# Altium schematic sheet MCU.SchDoc
size A3; SheetNumber: 2; SheetTotal: 5
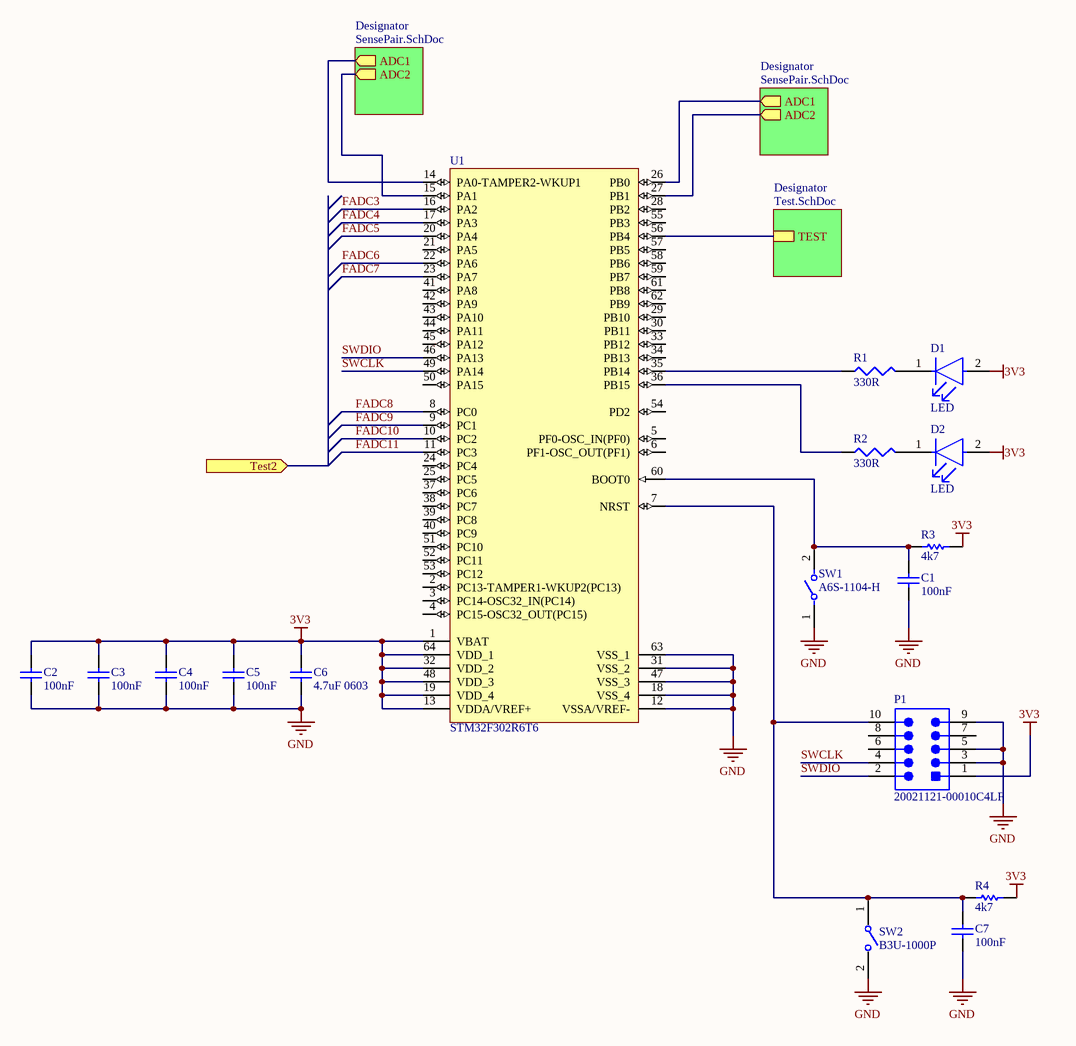
[diagram p0: MCU.SchDoc]

## Parts
C1  100nF  [CAPC1608X90X35LL15T15]
C2  100nF  [CAPC1608X90X35LL15T15]
C3  100nF  [CAPC1608X90X35LL15T15]
C4  100nF  [CAPC1608X90X35LL15T15]
C5  100nF  [CAPC1608X90X35LL15T15]
C6  4.7uF 0603  [CAPC1608X90X30LL10T20]
C7  100nF  [CAPC1608X90X35LL15T15]
D1  LED  [FP-LTST-C191TBKT-MFG]
D2  LED  [FP-LTST-C191TBKT-MFG]
P1  20021121-00010C4LF  [HDR2X5_SMT]
R1  330R  [J1-0603]
R2  330R  [J1-0603]
R3  4k7  [RESC1608X55X25LL10T15]
R4  4k7  [RESC1608X55X25LL10T15]
SW1  A6S-1104-H  [FP-A6S-1104-H-MFG]
SW2  B3U-1000P  [FP-B3U-1000P-MFG]
U1  STM32F302R6T6  [STM-LQFP64_L]

## Sub-sheets
Designator = Test.SchDoc: TEST
Designator = SensePair.SchDoc: ADC1 (out), ADC2 (out)
Designator = SensePair.SchDoc: ADC1 (out), ADC2 (out)

## Ports
Test2 (in)

## Nets
3V3: C2.2 C3.2 C4.2 C5.2 C6.2 D1.2(A) D2.2(A) P1.1 R3.1 R4.1 U1.1(VBAT) U1.13(VDDA/VREF+) U1.19(VDD_4) U1.32(VDD_2) U1.48(VDD_3) U1.64(VDD_1)
GND: C1.1 C2.1 C3.1 C4.1 C5.1 C6.1 C7.1 P1.3 P1.5 P1.9 SW1.1 SW2.2 U1.12(VSSA/VREF-) U1.18(VSS_4) U1.31(VSS_2) U1.47(VSS_3) U1.63(VSS_1)
FADC3: U1.16(PA2)
FADC4: U1.17(PA3)
FADC5: U1.20(PA4)
FADC6: U1.22(PA6)
FADC7: U1.23(PA7)
FADC8: U1.8(PC0)
FADC9: U1.9(PC1)
FADC10: U1.10(PC2)
FADC11: U1.11(PC3)
SWCLK: P1.4 U1.49(PA14)
SWDIO: P1.2 U1.46(PA13)
NetC1_2: C1.2 R3.2 SW1.2 U1.60(BOOT0)
NetC7_2: C7.2 P1.10 R4.2 SW2.1 U1.7(NRST)
NetD1_1: D1.1(C) R1.2
NetD2_1: D2.1(C) R2.2
NetR1_1: R1.1 U1.35(PB14)
NetR2_1: R2.1 U1.36(PB15)
NetU1_14: U1.14(PA0-TAMPER2-WKUP1) ; sheet Designator/ADC1
NetU1_15: U1.15(PA1) ; sheet Designator/ADC2
NetU1_26: U1.26(PB0) ; sheet Designator/ADC1
NetU1_27: U1.27(PB1) ; sheet Designator/ADC2
NetU1_56: U1.56(PB4) ; sheet Designator/TEST

Not connected (* = marked no-connect by the designer): P1 6 7 8; U1 2(PC13-TAMPER1-WKUP2(PC13)) 3(PC14-OSC32_IN(PC14)) 4(PC15-OSC32_OUT(PC15)) 5(PF0-OSC_IN(PF0)) 6(PF1-OSC_OUT(PF1)) 21(PA5) 24(PC4) 25(PC5) 28(PB2) 29(PB10) 30(PB11) 33(PB12) 34(PB13) 37(PC6) 38(PC7) 39(PC8) 40(PC9) 41(PA8) 42(PA9) 43(PA10) 44(PA11) 45(PA12) 50(PA15) 51(PC10) 52(PC11) 53(PC12) 54(PD2) 55(PB3) 57(PB5) 58(PB6) 59(PB7) 61(PB8) 62(PB9)

## Library data of the parts
C1-C5 C7 = CMP-2006-04199-2: Chip Capacitor, 100 nF, 25 V, -30 to 85 degC, 0603 (1608 Metric), RoHS, Tape and Reel; Manufacturer: AVX; Dielectric: Y5V; Rated Voltage: 25V; Tolerance (%): -20to+80%; Datasheet Version: 01/2010; Package Description: 2-Pin Surface Mount Device, Body 1.6 x 0.8 mm; Manufacturer URL: http://www.avx.com/; Datasheet URL: http://datasheet.octopart.com/06033G104ZAT2A-AVX-datasheet-8445862.pdf; Package Reference: 0603; Case Size/Dimension: 0603; Mounting Technology: SurfaceMount; Capacitance: 100nF
C6 = CMP-2000-06090-1: Chip Capacitor, 4.7 uF, +/- 10%, 6.3 V, -55 to 85 degC, 0603 (1608 Metric), RoHS, Tape and Reel; Manufacturer: Samsung Electro-Mechanics; Dielectric: X5R; Capacitance: 4700000pF; Rated Voltage: 6.3V; Manufacturer URL: http://www.samsungsem.com/global/index.jsp; Case Size/Dimension: 0603; Package Description: 2-Pin Surface Mount Device, Body 1.60 x 0.80 mm; Datasheet Version: 07/2016; Datasheet URL: http://www.samsungsem.com/kr/support/product-search/mlcc/__icsFiles/afieldfile/2016/08/18/S_CL10A475KQ8NNNC.pdf; Tolerance (%): ±10%; Mounting Technology: SurfaceMount; Package Reference: 0603
D1 D2 = CMP-22017-000008-1: LED BLUE CLEAR CHIP SMD; Lens Color: Colorless; Dominant Wavelength: 475nm; Forward Current: 20mA; Wavelength: 468nm; Viewing Angle: 130°; Power Dissipation: 76mW; Luminous Intensity: 180mcd; Reverse Voltage: 5V; Number of Elements: 1; Lens Style: Diffused; Forward Voltage: 3.8V; Max Power Dissipation: 75mW; Case Code (Metric): 1608; Packaging: Tape and Reel; Case/Package: 0603; Depth: 1.6mm; Mount: Surface Mount; Lead Free: Lead Free; Min Operating Temperature: -20°C; Lens Transparency: Clear; Illumination Color: Blue; Height: 0.55mm; Test Current: 20mA; Case Code (Imperial): 0603; Max Operating Temperature: 80°C; Number of Pins: 2; Length: 0.8mm; Radiation Hardening: No; Package Quantity: 1; Number of LEDs: 1; Width: 0.8mm; Color: Blue
P1 = CMP-2000-05523-1: Male Header, Pitch 1.27 mm, 2 x 5 Position, Height 4.55 mm, -40 to 85 degC, RoHS, Tape and Reel; Brand: FCI; Mating Post Length: 3.05mm; Voltage Rating: 125V; Contact resistance Max: 30MOhm; Number of Positions: 10; Pitch: 1.27mm; Current Rating: 1A; Stack Height: 3mm; Mounting Angle: Vertical; Package Version: Rev. J, 03/2013; Contact Plating: Gold; Packaging: Reel; Package Reference: 20021121; Termination Style: SMD; Series: Minitek; Mounting Technology: SurfaceMount; RoHS: Details; Manufacturer: FCI; Number of Rows: 2; Package Description: 10-Leads Header, Body 3.43 x 6.35, Pitch 1.27 mm; Datasheet URL: https://datasheet.ciiva.com/11749/0900766b8118d62a-11749057.pdf; Gender: Male; Mounting Style: SMD/SMT; Manufacturer URL: http://portal.fciconnect.com/; Factory Pack Quantity: 600; Type: Unshrouded; Number of Positions / Contacts: 10; Datasheet Version: 06/2011; Package URL: https://datasheet.ciiva.com/26853/getdatasheetpartid-177140-26853984.pdf; Product Type: Headers; Contact Material: CopperAlloy; Product Category: Headers&WireHousings
R1 = Res3: Resistor; Published: 8-Jun-2000; LatestRevisionDate: 29-May-2009; LatestRevisionNote: IPC-7351 Footprint Added.; PackageReference: J1-0603; Publisher: Altium Limited; PackageDescription: Chip Resistor
R2 = Res3: Resistor; Value: 1K; Published: 8-Jun-2000; LatestRevisionDate: 29-May-2009; LatestRevisionNote: IPC-7351 Footprint Added.; PackageReference: J1-0603; Publisher: Altium Limited; PackageDescription: Chip Resistor
R3 R4 = CMP-2000-06942-1: Chip Resistor, 4.7 KOhm, +/- 1%, 0.1 W, -55 to 155 degC, 0603 (1608 Metric), RoHS, Tape and Reel; Manufacturer: Yageo; Power Rating: 100mW; Temperature Coefficient: 100PPM/C; Resistance: 4.7kOhms; Voltage Rating: 50V; Package Reference: 0603; Series: RC; Datasheet Version: Rev. 7, 05/2017; Packaging: Reel; Termination Style: SMD/SMT; Datasheet URL: http://www.yageo.com/documents/recent/PYu-RC_Group_51_RoHS_L_7.pdf; Manufacturer URL: http://www.yageo.com/; Package Description: 2-Pin Surface Mount Device, Body 1.6 x 0.8 mm; Case Code - mm: 1608; Case Code - in: 0603; Mounting Technology: SurfaceMount; Operating Temperature Range: -55Cto+155C; Tolerance: 1%; Product: ThickFilmResistorsGeneralPurpose
SW1 = CMP-08827-000005-1: SWITCH SLIDE DIP SPST 25MA 24V; Manufacturer: Omron Electronics Inc-EMC Div; Throw Configuration: SPST-NO; Standoff Height: 0mm; Number Of Circuits: 1; Electromechanical Life: 1000Cycles; Contact Resistance: 200mΩ; Digikey Description: SWITCH SLIDE DIP SPST 25MA 24V; ComponentLink2Description: Datasheet; Mount: Surface Mount; Manufacturer Part Number: A6S-1104-H; ComponentLink2URL: https://omronfs.omron.com/en_US/ecb/products/pdf/en-a6s.pdf; Category: Switch; Height: 3.95mm; Device Class L3: DIP Switches; Octopart: https://octopart.com/a6s-1104-h-omron-55410938; Mouser Description: DIP Switches / SIP Switches Dip Switch; Lead Free: Yes; Temperature Range Low: -20°C; Temperature Range High: +70°C; Automotive: No; Ambient Temperature Range Low: -20°C; Ambient Temperature Range High: +70°C; Voltage Rating Dc: 24V; Device Class L2: Switches; RoHS: TRUE; Package: 0; Contact Current Rating: 25mA; Device Class L1: Electromechanical; Temperature: -20°C to +70°C
SW2 = CMP-2100-03586-2: SWITCH TACTILE SPST-NO 0.05A 12V; Contact Resistance: 100mR; Operating Force: 1.5N; Max Current Rating: 50mA; Switch Travel: 0.15mm; Actuator Type: Standard; Mechanical Life: 200000Cycles; Ratings: Dust Proof; Illumination Type: Non-Illuminated; Throw Configuration: SPST; Actuator Length: 0.4mm; Switch Function: Off-Mom; Height: 1.2mm; Width: 3mm; Weight: 0.000776oz; Contact Material: Silver; Max Voltage Rating (DC): 12V; Insulation Resistance: 100MR; Lead Free: Lead Free; Current Rating: 50mA; Termination: SMD/SMT; Length: 4mm; Voltage Rating (DC): 12V; Contact Current Rating: 50mA; Orientation: Straight; Depth: 2.5mm; Max Operating Temperature: 70°C; Packaging: Tape and Reel; Min Operating Temperature: -25°C; Package Quantity: 1; Mount: Surface Mount; Electrical Life: 200000Cycles
U1 = CMP-0537-00017-1: ARM Cortex-M4 32-bit MCU, 32 KB Flash, 16 KB Internal RAM, 51 I/Os, 64-Pin LQFP, -40 to 85 degC, Tray; Operating Frequency(F) (Processor speed) (MHz): 72; Internal RAM Size (kB): 16; I/Os (High Current): 51; Supply Voltage(Vcc) min (V): 2; FLASH Size (Prog) (kB): 32; D/A Converter: 1; ComponentLink1Description: Manufacturer URL; Core: ARM Cortex-M4; Mounting Technology: Surface Mount; Packing: Tray; Package Description: 64-Pin Low-profile Quad Flat Package, Body 10 x 10 mm, Pitch 0.5 mm; ComponentLink2URL: http://www.st.com/st-web-ui/static/active/en/resource/technical/document/datasheet/DM00093333.pdf; Package Reference: LQFP64; ComponentLink1URL: http://www.st.com/; ComponentLink2Description: Datasheet; DatasheetVersion: Rev. 5